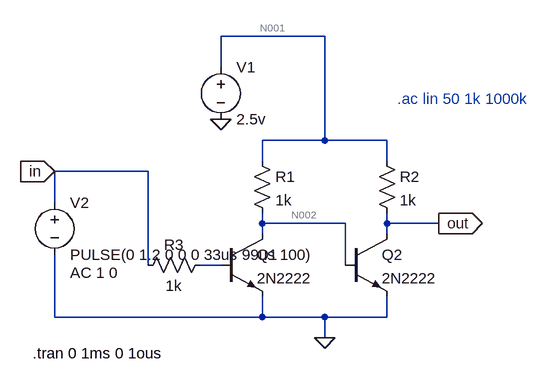
[diagram p0: schematic translator.asc]
translator.asc, the LTspice schematic file:
Version 4
SHEET 1 880 680
WIRE 304 -192 144 -192
WIRE 144 -144 144 -192
WIRE 304 -32 304 -192
WIRE 304 -32 208 -32
WIRE 400 -32 304 -32
WIRE 208 0 208 -32
WIRE 400 0 400 -32
WIRE 32 16 -112 16
WIRE -112 64 -112 16
WIRE 208 96 208 80
WIRE 336 96 208 96
WIRE 400 96 400 80
WIRE 480 96 400 96
WIRE 208 112 208 96
WIRE 400 112 400 96
WIRE 32 160 32 16
WIRE 144 160 112 160
WIRE 336 160 336 96
WIRE -112 240 -112 144
WIRE 208 240 208 208
WIRE 208 240 -112 240
WIRE 304 240 208 240
WIRE 400 240 400 208
WIRE 400 240 304 240
WIRE 304 272 304 240
FLAG 304 272 0
FLAG 144 -64 0
FLAG 480 96 out
IOPIN 480 96 Out
FLAG -112 16 in
IOPIN -112 16 In
SYMBOL npn 144 112 R0
SYMATTR InstName Q1
SYMATTR Value 2N2222
SYMBOL npn 336 112 R0
SYMATTR InstName Q2
SYMATTR Value 2N2222
SYMBOL res 192 -16 R0
SYMATTR InstName R1
SYMATTR Value 1k
SYMBOL res 384 -16 R0
SYMATTR InstName R2
SYMATTR Value 1k
SYMBOL res 128 144 R90
WINDOW 0 0 56 VBottom 2
WINDOW 3 32 56 VTop 2
SYMATTR InstName R3
SYMATTR Value 1k
SYMBOL voltage 144 -160 R0
WINDOW 123 0 0 Left 0
WINDOW 39 0 0 Left 0
SYMATTR InstName V1
SYMATTR Value 2.5v
SYMBOL voltage -112 48 R0
WINDOW 123 24 124 Left 2
WINDOW 39 0 0 Left 0
SYMATTR InstName V2
SYMATTR Value PULSE(0 1.2 0 0 0 33us 99us 100)
SYMATTR Value2 AC 1 0
TEXT 416 -96 Left 2 ;.ac lin 50 1k 1000k
TEXT -146 296 Left 2 !.tran 0 1ms 0 1ous

The netlist it stands for:
* translator.asc
Q1 N002 N003 0 0 2N2222
Q2 out N002 0 0 2N2222
R1 N001 N002 1k
R2 N001 out 1k
R3 N003 in 1k
V1 N001 0 2.5v
V2 in 0 PULSE(0 1.2 0 0 0 33us 99us 100) AC 1 0
.model NPN NPN
.model PNP PNP
.lib standard.bjt
* .ac lin 50 1k 1000k
.tran 0 1ms 0 1ous
.backanno
.end

* Results of the author's LTspice run, read from the files saved beside the schematic
* Operating Point, zero values left out:
*   V(n002) = 731.9 mV
*   V(out) = 17.44 mV
*   V(n001) = 2.5 V
*   Ic(Q2) = 2.483 mA
*   Ib(Q2) = 1.768 mA
*   Ie(Q2) = -4.251 mA
*   I(R2) = 2.483 mA
*   I(R1) = 1.768 mA
*   I(V1) = -4.251 mA
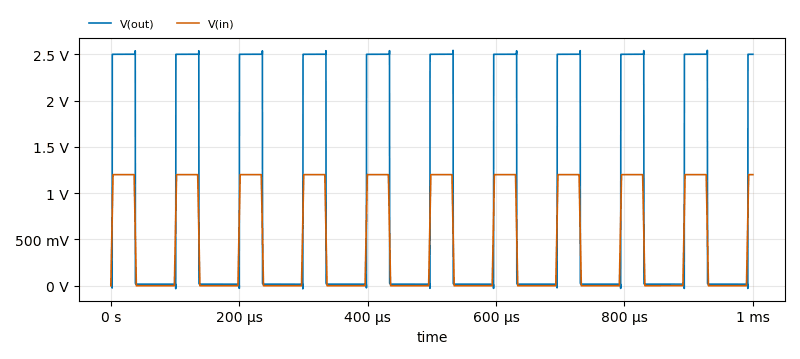
[diagram p1: Transient Analysis of translator.asc, plotted from the saved traces]
* Transient Analysis, 1 run:
*   V(out): min -32.92 mV, max 2.542 V, average 930 mV, rms 1.516 V, last 2.5 V
*   V(in): min 0 V, max 1.2 V, average 445.6 mV, rms 719.9 mV, last 1.2 V